# EAGLE design esp32_10 (EAGLE 7.3.0)
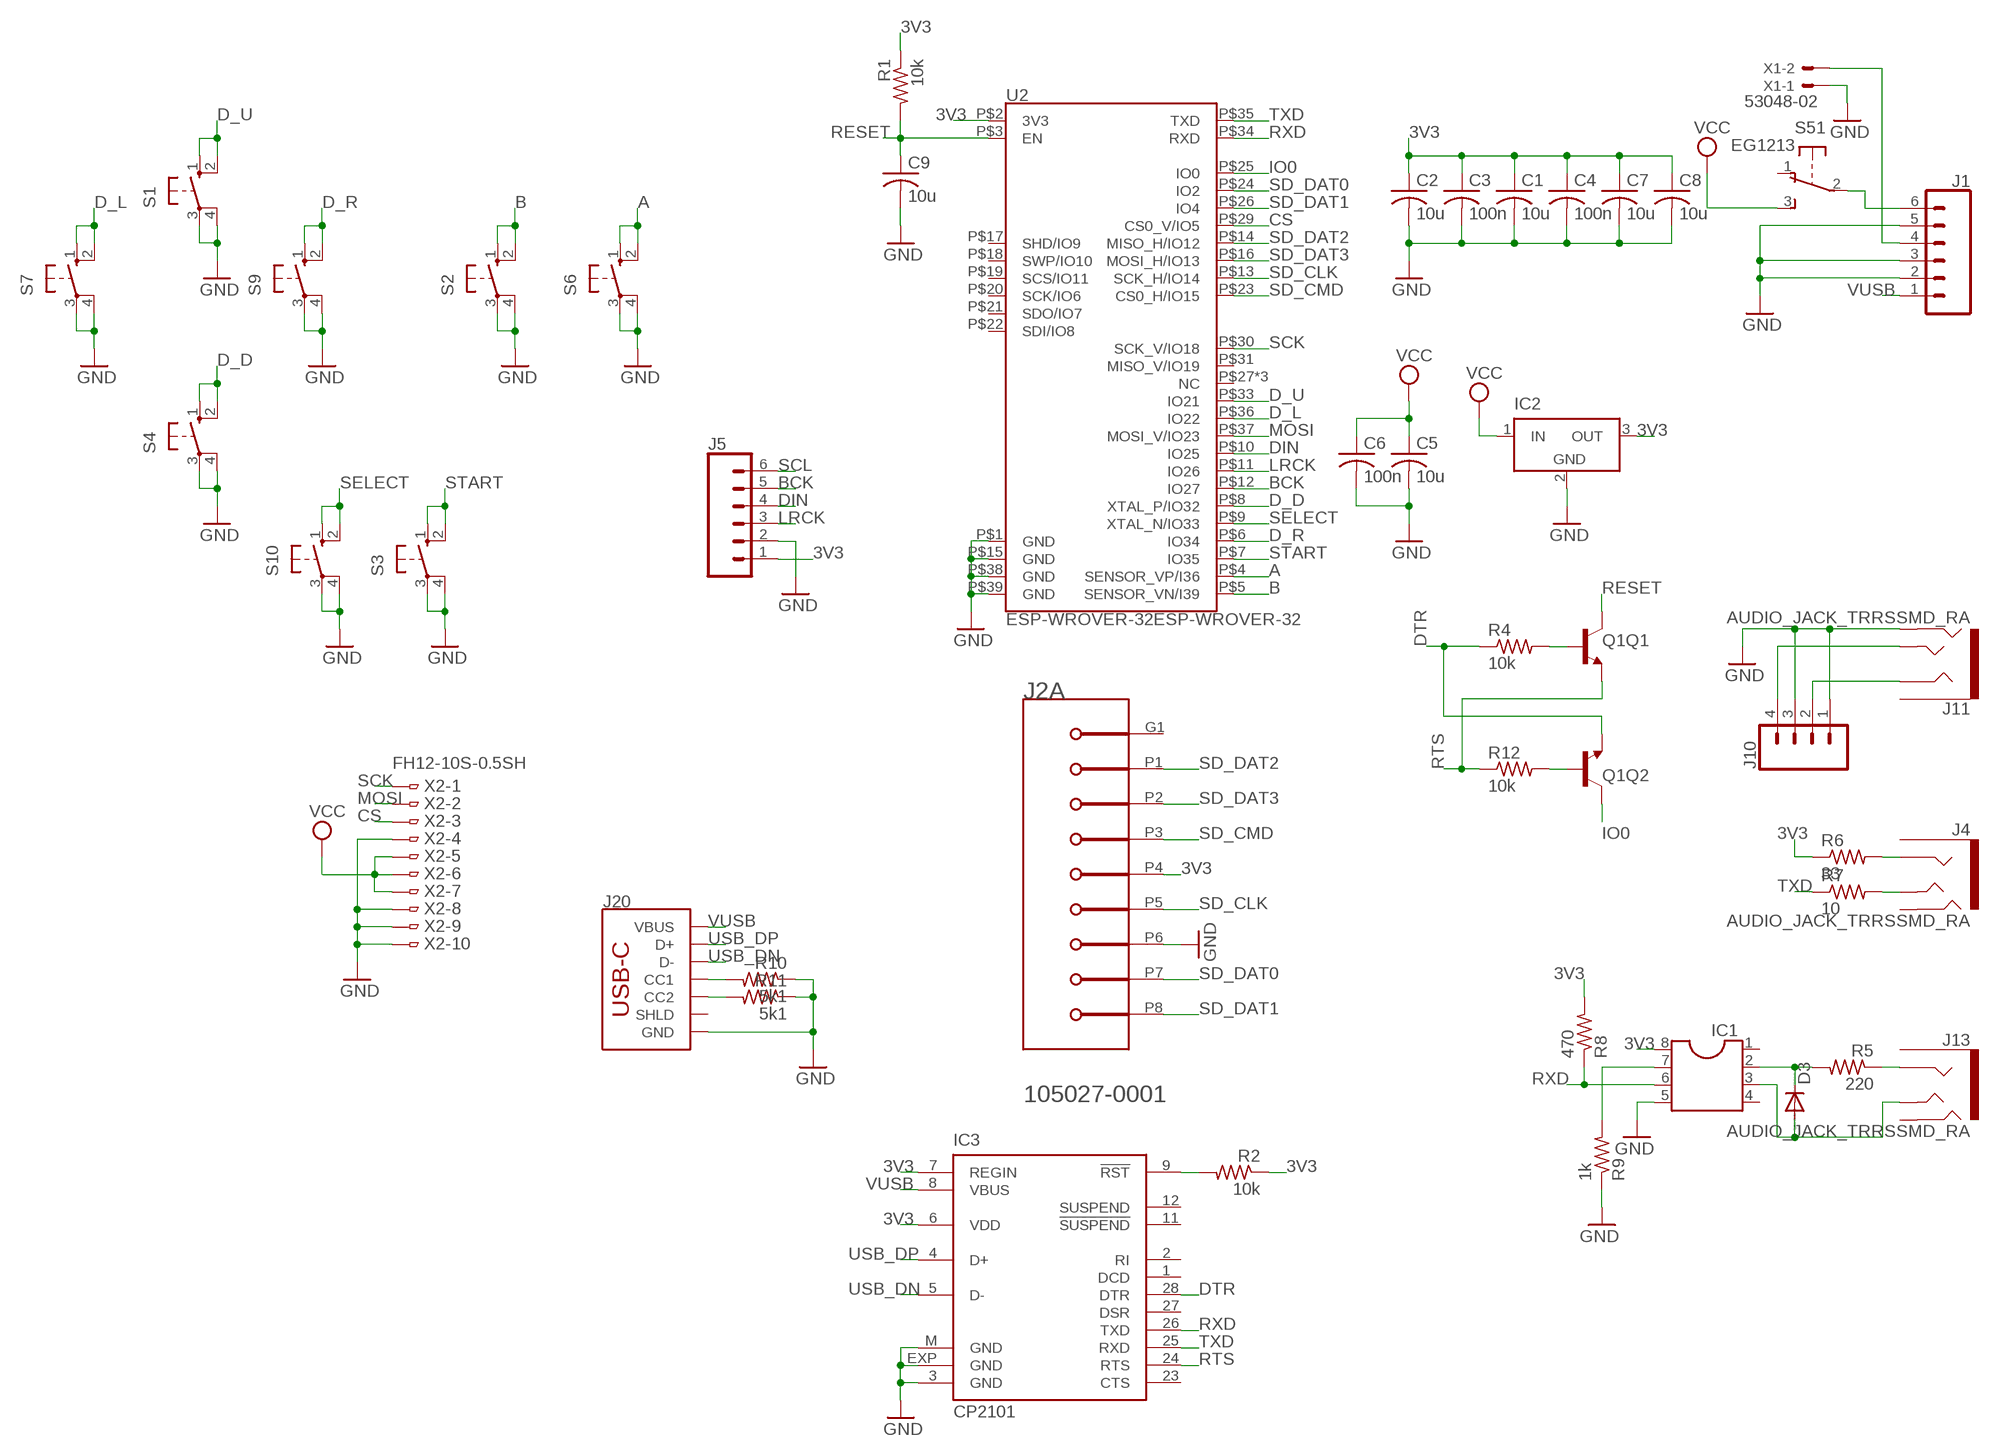
[diagram p0: schematic, sheet 1]

## Parts
C1  10u  C-USC0805  [C0805]
C2  10u  C-USC0805  [C0805]
C3  100n  C-USC0805  [C0805]
C4  100n  C-USC0805  [C0805]
C5  10u  C-USC0805  [C0805]
C6  100n  C-USC0805  [C0805]
C7  10u  C-USC0805  [C0805]
C8  10u  C-USC0805  [C0805]
C9  10u  C-USC0805  [C0805]
D3  DIODE-MINIMELF  [MINIMELF]
IC1  DIL8  [DIL08]
IC2  LT1129CST5  [SOT223]
IC3  CP2101  CP210X_USB_UART  [MLP28]
J1  CONN_06SILK_FEMALE_PTH  [1X06]
J2  MOLEX_INC_105027-0001MOLEX_INC_105027-0001_0_0  [MOLEX_INC_105027-0001_0]
J4  AUDIO_JACK_TRRSSMD_RA  [AUDIO_JACK_3.5MM_TRRS_SMD_RA]
J5  CONN_06SILK_FEMALE_PTH  [1X06]
J10  CONN_04  [1X04]
J11  AUDIO_JACK_TRRSSMD_RA  [AUDIO_JACK_3.5MM_TRRS_SMD_RA]
J13  AUDIO_JACK_TRRSSMD_RA  [AUDIO_JACK_3.5MM_TRRS_SMD_RA]
J20  USB_C_2-LAYER_PADS  [USB-C-16P-2LAYER-PADS]
Q1  TRANS_NPN_DUAL-MBT3904DW1T1  [SC70-6]
R1  10k  R-US_R0805  [R0805]
R2  10k  R-US_R0805  [R0805]
R4  10k  R-US_R0805  [R0805]
R5  220  R-US_R0805  [R0805]
R6  33  R-US_R0805  [R0805]
R7  10  R-US_R0805  [R0805]
R8  470  R-US_R0805  [R0805]
R9  1k  R-US_R0805  [R0805]
R10  5k1  R-US_R0805  [R0805]
R11  5k1  R-US_R0805  [R0805]
R12  10k  R-US_R0805  [R0805]
S1  10-XX  [B3F-10XX]
S2  10-XX  [B3F-10XX]
S3  10-XX  [B3F-10XX]
S4  10-XX  [B3F-10XX]
S5  EG1213  [EG1213]
S6  10-XX  [B3F-10XX]
S7  10-XX  [B3F-10XX]
S9  10-XX  [B3F-10XX]
S10  10-XX  [B3F-10XX]
U2  ESP-WROVER-32ESP-WROVER-32  [ESP-WROVER-32]
X1  53048-02  [53048-02]
X2  FH12-10S-0.5SH  [FH12-10S-0.5SH]

## Nets
3V3: C1.1 C2.1 C3.1 C4.1 C7.1 C8.1 IC1.8 IC2.3(OUT) IC3.6(VDD) IC3.7(REGIN) J2.P4(A:VDD) J5.1 R1.1 R2.1 R6.1 R8.2 U2.P$2(3V3)
A: S6.1(S) S6.2(S1) U2.P$4(SENSOR_VP/I36)
B: S2.1(S) S2.2(S1) U2.P$5(SENSOR_VN/I39)
BCK: J5.5 U2.P$12(IO27)
CS: U2.P$29(CS0_V/IO5) X2.3
D_D: S4.1(S) S4.2(S1) U2.P$8(XTAL_P/IO32)
D_L: S7.1(S) S7.2(S1) U2.P$36(IO22)
D_R: S9.1(S) S9.2(S1) U2.P$6(IO34)
D_U: S1.1(S) S1.2(S1) U2.P$33(IO21)
DIN: J5.4 U2.P$10(IO25)
DTR: IC3.28(DTR) Q1.1(Q2:E) R4.1
GND: C1.2 C2.2 C3.2 C4.2 C5.2 C6.2 C7.2 C8.2 C9.2 IC1.5 IC2.2(GND) IC3.3(GND) IC3.EXP(GND) IC3.M(GND) J1.2 J1.3 J1.5 J2.P6(A:VSS) J5.2 J10.1 J10.3 J11.RING2 J20.GND J20.GND2(GND) R9.1 R10.1 R11.1 S1.3(P) S1.4(P1) S2.3(P) S2.4(P1) S3.3(P) S3.4(P1) S4.3(P) S4.4(P1) S6.3(P) S6.4(P1) S7.3(P) S7.4(P1) S9.3(P) S9.4(P1) S10.3(P) S10.4(P1) U2.P$1(GND) U2.P$15(GND) U2.P$38(GND) U2.P$39(GND) X1.1 X2.4 X2.8 X2.9 X2.10
IO0: Q1.6(Q2:C) U2.P$25(IO0)
LRCK: J5.3 U2.P$11(IO26)
MOSI: U2.P$37(MOSI_V/IO23) X2.2
N$4: J10.4 J11.TIP
N$5: J10.2 J11.RING1
N$6: J1.4 X1.2
N$7: Q1.2(Q2:B) R12.2
N$8: J20.A5(CC1) R10.2
N$9: J20.B5(CC2) R11.2
N$10: Q1.5(Q1:B) R4.2
N$14: J4.RING1 R6.2
N$16: J4.TIP R7.2
N$17: J13.RING1 R5.1
N$18: D3.C IC1.2 R5.2
N$19: D3.A IC1.3 J13.TIP
N$22: IC1.7 R9.2
N$24: J1.6 S5.2(1:P)
N$26: IC3.9(!RST) R2.2
RESET: C9.1 Q1.3(Q1:C) R1.2 U2.P$3(EN)
RTS: IC3.24(RTS) Q1.4(Q1:E) R12.1
RXD: IC1.6 IC3.26(TXD) R8.1 U2.P$34(RXD)
SCK: U2.P$30(SCK_V/IO18) X2.1
SCL: J5.6
SD_CLK: J2.P5(A:CLK) U2.P$13(SCK_H/IO14)
SD_CMD: J2.P3(A:CMD) U2.P$23(CS0_H/IO15)
SD_DAT0: J2.P7(A:DAT0) U2.P$24(IO2)
SD_DAT1: J2.P8(A:DAT1) U2.P$26(IO4)
SD_DAT2: J2.P1(A:DAT2) U2.P$14(MISO_H/IO12)
SD_DAT3: J2.P2(A:CD/DAT3) U2.P$16(MOSI_H/IO13)
SELECT: S10.1(S) S10.2(S1) U2.P$9(XTAL_N/IO33)
START: S3.1(S) S3.2(S1) U2.P$7(IO35)
TXD: IC3.25(RXD) R7.1 U2.P$35(TXD)
USB_DN: IC3.5(D-) J20.A7(D-) J20.B7(D-)
USB_DP: IC3.4(D+) J20.A6(D+) J20.B6(D+)
VCC: C5.1 C6.1 IC2.1(IN) S5.3(1:S) X2.5 X2.6 X2.7
VUSB: IC3.8(VBUS) J1.1 J20.VBUS1(VBUS) J20.VBUS2(VBUS)
Unconnected: IC1.1 IC1.4 IC3.1(DCD) IC3.2(RI) IC3.11(!SUSPEND) IC3.12(SUSPEND) IC3.23(CTS) IC3.27(DSR) J2.1(B:MNT_1) J2.2(B:MNT_2) J2.3(B:MNT_3) J2.4(B:MNT_4) J2.G1(A:SWITCH) J4.EARTH J4.RING2 J11.EARTH J13.EARTH J13.RING2 J20.SHLD1(SHLD) J20.SHLD2(SHLD) J20.SHLD3(SHLD) J20.SHLD4(SHLD) S5.1(1:O) S5.MT1(MT) S5.MT2(MT) U2.P$17(SHD/IO9) U2.P$18(SWP/IO10) U2.P$19(SCS/IO11) U2.P$20(SCK/IO6) U2.P$21(SDO/IO7) U2.P$22(SDI/IO8) U2.P$27(NC) U2.P$28(NC) U2.P$31(MISO_V/IO19) U2.P$32(NC)

## Power pins joined to a net without a drawn wire
GND: IC2.4(GND)

## Library data of the parts
C1-C9 = rcl:C-US: CAPACITOR, American symbol
D3 = diode:DIODE-: DIODE
IC1 = ic-package:DIL8: Dual In Line / Socket
IC2 = linear-technology:LT1129CST5: VOLTAGE REGULATOR with shutdown; MPN: LT1129CST-5#PBF; OC_FARNELL: 1663375; OC_NEWARK: 57M2069
IC3 = SparkFun-Retired:CP210X_USB_UART: Single-Chip USB to UART Bridge Source: www.silabs.com .. CP2101.pdf / cp2102.pdf. Spark Fun Electronics SKU : COM-00310 RETIRED: IC-00865; PROD_ID: COM-00310
J1 J5 = lbr_SparkFun-Eagle-Libraries_SparkFun-Connectors:CONN_06: Multi connection point. Often used as Generic Header-pin footprint for 0.1 inch spaced/style header connections On any of the 0.1 inch spaced packages, you can populate with these: Break Away Headers - Straight <https://www.sparkfun.com/products/116> (PRT-00116) Break Away Male Headers - Right Angle <https://www.sparkfun.com/products/553> (PRT-00553) Female Headers <https://www.sparkfun.com/products/115> (PRT-00115) Break Away Headers - Machine Pin <https://www.sparkfun.com/products/117> (PRT-00117) Break Away Female Headers - Swiss Machine Pin <https://www.sparkfun.com/products/743> (PRT-00743) Arduino Stackable Header - 6 Pin <https://www.sparkfun.com/products/9280> (PRT-09280) For SCREWTERMINALS and SPRING TERMINALS visit here: Screw Terimnals on SparkFun.com <https://www.sparkfun.com/search/results?term=Screw+Terminals> (5mm/3.5mm/2.54mm spacing) This device is also useful as a general connection point to wire up your design to another part of your project. Our various solder wires solder well into these plated through hole pads. Hook-Up Wire - Assortment (Stranded, 22 AWG) <https://www.sparkfun.com/products/11375> (PRT-11375) Hook-Up Wire - Assortment (Solid Core, 22 AWG) <https://www.sparkfun.com/products/11367> (PRT-11367) View the entire wire category on our website here <https://www.sparkfun.com/categories/141>; PROD_ID: CONN-08437
J2 = Molex Inc - 105027-0001:MOLEX_INC_105027-0001: CONN MICRO SD CARD PUSH-PULL R/A; AUTOMOTIVE: No; CENTROID_NOT_SPECIFIED: No; CONN_ORIENTATION: Horizontal; CONTACT_MATERIAL: Gold,Nickel; CURRENT_RATING: 0.5A; DATASHEET: http://www.molex.com/webdocs/datasheets/pdf/en-us/1050270001_MEMORY_CARD_SOCKET.pdf; DEVICE_CLASS_L1: Connectors; DEVICE_CLASS_L2: Memory Connectors; DEVICE_CLASS_L3: unset; DIGIKEY_DESCRIPTION: CONN MICRO SD CARD PUSH-PULL R/A; DIGIKEY_PART_NUMBER: WM6825CT-ND; FOOTPRINT_URL: https://www.molex.com/pdm_docs/sd/1050270001_sd.pdf; FOOTPRINT_VARIANT_NAME_0: Recommended_Land_Pattern; HEIGHT: 1.85mm; IS_FEMALE: yes; LEAD_FREE: Yes; MEMORY_TYPE: FLASH; MF: Molex Inc; MFG_PACKAGE_IDENT: 105027-0001; MFG_PACKAGE_IDENT_DATE: 0; MFG_PACKAGE_IDENT_REV: 0; MOUSER_DESCRIPTION: Conn Micro SD Card HDR 8 POS 1.1mm Solder RA SMD Embossed T/R 0.5A/Contact; MOUSER_PART_NUMBER: 538-105027-0001; MPN: 105027-0001; NUMBER_OF_CONTACTS: 9; PACKAGE: CONN_SMT_SD; PREFIX: J; ROHS: Yes; SHIELDING: true; TEMPERATURE_RANGE_HIGH: +85°C; TEMPERATURE_RANGE_LOW: -40°C; VERIFICATION_VERSION: 0.0.0.1; VOLTAGE_RATING: 5V
J4 J11 J13 = lbr_SparkFun-Eagle-Libraries_SparkFun-Connectors:AUDIO_JACK_TRRS: Audio Jack - 3.5mm TRRS (SMD) This is a 3.5mm TRRS SMD audio jack. TRRS connectors are the audio-style connectors that you see on some phones, MP3 players and development boards. TRRS stands for “tip, ring, ring, sleeve,” which reflects that this has three conductors and a ground. SparkFun Products: Audio Jack <https://www.sparkfun.com/products/12639> mbed Starter Kit <https://www.sparkfun.com/products/12968> SparkFun TRRS 3.5mm Jack Breakout <https://www.sparkfun.com/products/11570>; PROD_ID: CONN-10676; SF_ID: PRT-12639
J10 = lbr_SparkFun-Eagle-Libraries_SparkFun-Connectors:CONN_04: Multi connection point. Often used as Generic Header-pin footprint for 0.1 inch spaced/style header connections On any of the 0.1 inch spaced packages, you can populate with these: Break Away Headers - Straight <https://www.sparkfun.com/products/116> (PRT-00116) Break Away Male Headers - Right Angle <https://www.sparkfun.com/products/553> (PRT-00553) Female Headers <https://www.sparkfun.com/products/115> (PRT-00115) Break Away Headers - Machine Pin <https://www.sparkfun.com/products/117> (PRT-00117) Break Away Female Headers - Swiss Machine Pin <https://www.sparkfun.com/products/743> (PRT-00743) For SCREWTERMINALS and SPRING TERMINALS visit here: Screw Terimnals on SparkFun.com <https://www.sparkfun.com/search/results?term=Screw+Terminals> (5mm/3.5mm/2.54mm spacing) This device is also useful as a general connection point to wire up your design to another part of your project. Our various solder wires solder well into these plated through hole pads. Hook-Up Wire - Assortment (Stranded, 22 AWG) <https://www.sparkfun.com/products/11375> (PRT-11375) Hook-Up Wire - Assortment (Solid Core, 22 AWG) <https://www.sparkfun.com/products/11367> (PRT-11367) View the entire wire category on our website here <https://www.sparkfun.com/categories/141> Special notes: Molex polarized connector foot print use with SKU : PRT-08231 with associated crimp pins and housings. 1MM SMD Version SKU: PRT-10208; PROD_ID: CONN-09696
J20 = SparkFun-Connectors:USB_C: USB Type C 16Pin Connector Super Speed pins not available on the 16-pin purely SMD connector so this part is best for USB 2.0 implementations. D1 and D2 are tied together enabling D+/- no matter which way the cable is plugged into the connector. The two channel configuration pins (CC1/2) are exposed. These are normally connected to ground via 5.1k resistors but can be reconfigured for high current/high power applications. **4-LAYER BOARD WARNING!!** If designing 4-layer board, make sure to select the variant _4-LAYER-ISOLATED. The linked footprint (USB-C-16-4LAYER-ISOLATED) includes some very necessary cutout polygons in the inner layers (2 and 15). This prevents the PTH mounting shield legs on the USB connector from electrically connecting any other polygons on the inner layers (usually VCC and GND).; PROD_ID: CONN-14122
Q1 = SparkFun-DiscreteSemi:TRANS_NPN_DUAL: Dual NPN Transistors in Single Package The MBT3904W1 puts two general purpose 3904 NPN transistors in a single package. Datasheet <http://www.onsemi.com/pub_link/Collateral/MBT3904DW1T1-D.PDF> SparkFun Products: SparkFun ESP32 Thing <https://www.sparkfun.com/products/13907>; PROD_ID: TRANS-13337
R1 R2 R4-R12 = rcl:R-US_: RESISTOR, American symbol
S1-S4 S6 S7 S9 S10 = switch-omron:10-XX: OMRON SWITCH; MPN: B3F-1000; OC_FARNELL: 176432; OC_NEWARK: 36M3542
S5 = adafruit:EG1213: E-Switch right-angle slide SPDT Part #EG1213 http://www.ladyada.net/library/eagle
U2 = SparkFun-RF:ESP-WROVER-32
X1 = con-molex:53?-02: CONNECTOR wire to board 1.25 mm (.049 inch) pitch header; MF: MOLEX; MPN: 53048-0210; OC_FARNELL: 1012259; OC_NEWARK: 57H4718
X2 = con-hirose:FH12-10S-0.5S: 0.5mm Pitch Connectors For FPC/FFC Source: Data sheet <http://www.hirose.co.jp/cataloge_hp/e58605370.pdf>; MPN: FH12-10S-0.5SH(55); OC_FARNELL: 1324540; OC_NEWARK: 34M6152

## Board
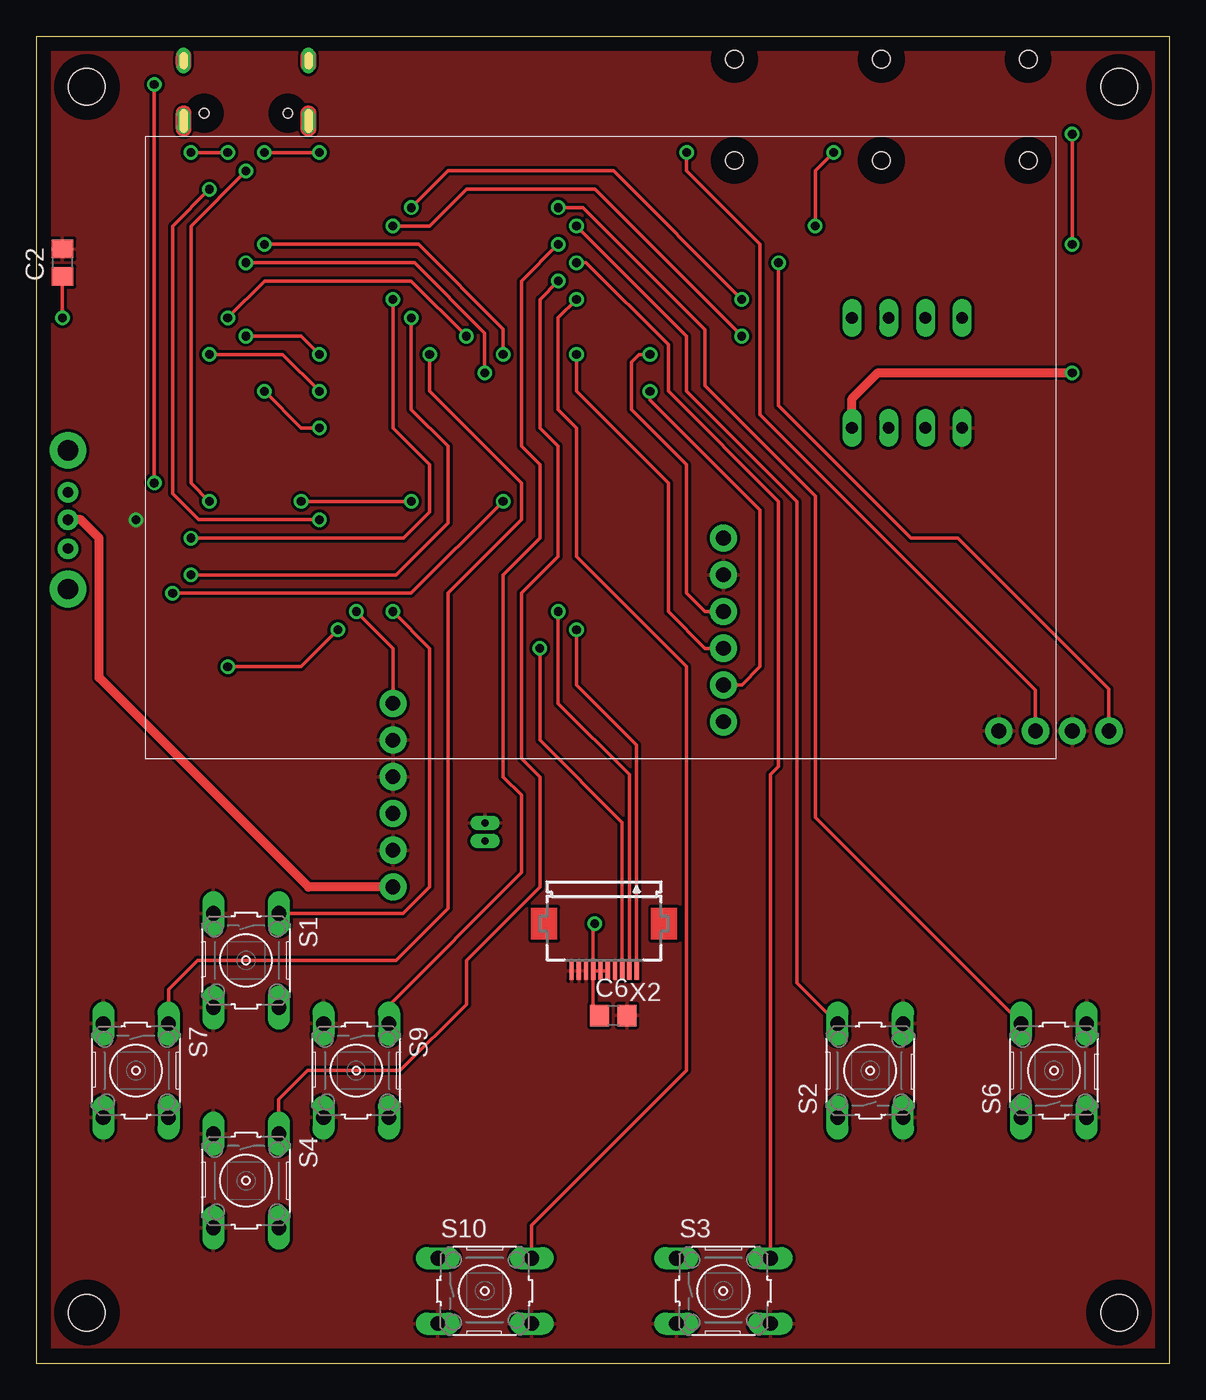
[diagram p1: board, top side]
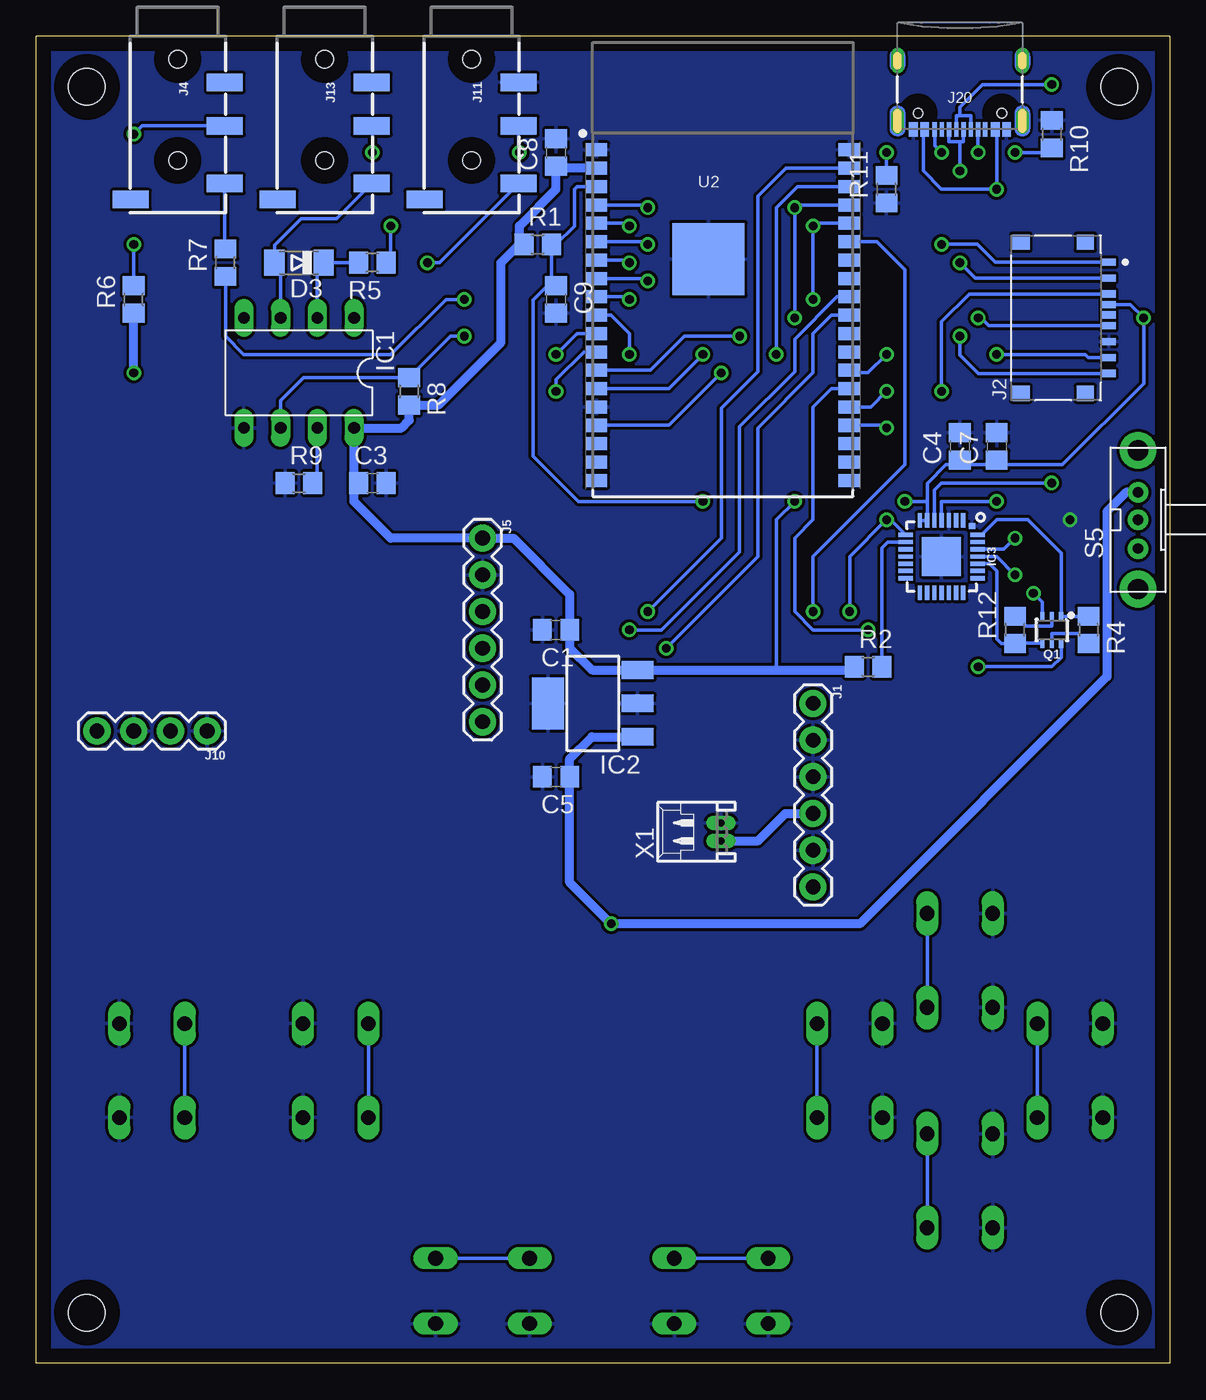
[diagram p2: board, bottom side, seen from below]

Size 78.42 x 91.8 mm. Coordinates in mm from the lower left corner, seen from the top.
Outline: 0,91.8 0,0 78.42,0 78.42,91.8 0,91.8
Copper layers (1*16): Top 0.035mm / dielectric 1.5mm / Bottom 0.035mm
Design rules "default *": minimum track width 8mil, minimum drill 24mil, track to track 8mil, track to pad 8mil, pad to pad 8mil, via to via 8mil, smd to smd 8mil, copper to edge 40mil, drill to drill 8mil, minimum pad ring 10mil, minimum via ring 8mil, stop-mask expansion 4mil, vias tented up to drill 0mil, thermal gap 8mil
Holes 2.5 mm at 3.5,88.3 74.92,88.3 3.5,3.5 74.92,3.5

### Footprints (pad centres in the part's own frame; a part is rotated, then mirrored left to right if it is on the bottom)
C0805 = smd 1.3 x 1.5: 1 -0.95,0; 2 0.95,0
MINIMELF = smd 1.4 x 1.8: A 1.7,0; C -1.7,0
DIL08 = drill 0.813 long: 1 -3.81,-3.81; 2 -1.27,-3.81; 3 1.27,-3.81; 4 3.81,-3.81; 5 3.81,3.81; 6 1.27,3.81; 7 -1.27,3.81; 8 -3.81,3.81
SOT223 = smd 1.219 x 2.235: 1 -2.311,-3.099; 2 0,-3.099; 3 2.311,-3.099 | smd 3.6 x 2.2: 4 0,3.099
MLP28 = smd 1 x 0.3: 1 -2.5,1.5; 2 -2.5,1; 3 -2.5,0.5; 4 -2.5,0; 5 -2.5,-0.5; 6 -2.5,-1; 7 -2.5,-1.5; 15 2.5,-1.5; 16 2.5,-1; 17 2.5,-0.5; 18 2.5,0; 19 2.5,0.5; 20 2.5,1; 21 2.5,1.5 | smd 0.3 x 1: 8 -1.5,-2.5; 9 -1,-2.5; 10 -0.5,-2.5; 11 0,-2.5; 12 0.5,-2.5; 13 1,-2.5; 14 1.5,-2.5; 22 1.5,2.5; 23 1,2.5; 24 0.5,2.5; 25 0,2.5; 26 -0.5,2.5; 27 -1,2.5; 28 -1.5,2.5 | smd 2.7 x 2.7: EXP 0,0 | smd 0.435 x 0.435: M -2.103,2.103
1X06 = drill 1.016 pad 1.88: 1 0,0; 2 2.54,0; 3 5.08,0; 4 7.62,0; 5 10.16,0; 6 12.7,0
MOLEX_INC_105027-0001_0 = smd 1.05 x 1.2: 1 -5.225,2.13; 2 5.225,2.13; 3 -5.225,-2.32; 4 5.225,-2.32 | smd 0.5 x 1: G1 0.2,-3.93; P1 3.85,-3.93; P2 2.75,-3.93; P3 1.65,-3.93; P4 0.9,-3.93; P5 -0.55,-3.93; P6 -1.65,-3.93; P7 -2.75,-3.93; P8 -3.85,-3.93
AUDIO_JACK_3.5MM_TRRS_SMD_RA = smd 1.2 x 2.5: EARTH 11.3,-3.25; RING1 6.2,3.25; RING2 3.2,3.25; TIP 10.2,3.25 | hole 1.2: 1.6,0; 8.6,0
1X04 = drill 1.016 pad 1.88: 1 0,0; 2 2.54,0; 3 5.08,0; 4 7.62,0
USB-C-16P-2LAYER-PADS = smd 0.3 x 1: A5 -1.25,-0.34; A6 -0.25,-0.34; A7 0.25,-0.34; A8 1.25,-0.34; B5 1.75,-0.34; B6 0.75,-0.34; B7 -0.75,-0.34; B8 -1.75,-0.34 | smd 0.6 x 1: GND -3.225,-0.34; GND2 3.225,-0.34; VBUS1 -2.45,-0.34; VBUS2 2.45,-0.34 | drill 0.4 pad 0.6 long: SHLD1 -4.318,-0.915; SHLD2 4.318,-0.915; SHLD3 -4.318,-5.095; SHLD4 4.318,-5.095 | hole 0.65: -2.89,-1.445; 2.89,-1.445
SC70-6 = smd 0.3 x 0.66: 1 -0.65,-0.92; 2 0,-0.92; 3 0.65,-0.92; 4 0.65,0.92; 5 0,0.92; 6 -0.65,0.92
R0805 = smd 1.3 x 1.5: 1 -0.95,0; 2 0.95,0
B3F-10XX = drill 1.016 long: 1 -3.251,2.261; 2 3.251,2.261; 3 -3.251,-2.261; 4 3.251,-2.261
EG1213 = drill 0.7 pad 1.422: 1 -2,0; 2 0,0; 3 1.9,0 | drill 1.4 pad 2.54: MT1 -4.8,0; MT2 4.8,0
ESP-WROVER-32 = smd 1.5 x 0.9: P$1 0.25,-7.44; P$2 0.25,-8.71; P$3 0.25,-9.98; P$4 0.25,-11.25; P$5 0.25,-12.52; P$6 0.25,-13.79; P$7 0.25,-15.06; P$8 0.25,-16.33; P$9 0.25,-17.6; P$10 0.25,-18.87; P$11 0.25,-20.14; P$12 0.25,-21.41; P$13 0.25,-22.68; P$14 0.25,-23.95; P$15 0.25,-25.22; P$16 0.25,-26.49; P$17 0.25,-27.76; P$18 0.25,-29.03; P$19 0.25,-30.3; P$20 17.75,-30.3; P$21 17.75,-29.03; P$22 17.75,-27.76; P$23 17.75,-26.49; P$24 17.75,-25.22; P$25 17.75,-23.95; P$26 17.75,-22.68; P$27 17.75,-21.41; P$28 17.75,-20.14; P$29 17.75,-18.87; P$30 17.75,-17.6; P$31 17.75,-16.33; P$32 17.75,-15.06; P$33 17.75,-13.79; P$34 17.75,-12.52; P$35 17.75,-11.25; P$36 17.75,-9.98; P$37 17.75,-8.71; P$38 17.75,-7.44 | smd 5 x 5: P$39 8,-15
53048-02 = drill 0.5 pad 0.698 long: 1 0.625,-1.25; 2 -0.625,-1.25
FH12-10S-0.5SH = smd 0.3 x 1.3: 1 -2.25,3.25; 2 -1.75,3.25; 3 -1.25,3.25; 4 -0.75,3.25; 5 -0.25,3.25; 6 0.25,3.25; 7 0.75,3.25; 8 1.25,3.25; 9 1.75,3.25; 10 2.25,3.25

### Placement (x,y rotation side)
C1  42.46,50.73 180 bottom
C2  1.82,76.13 90 top
C3  55.16,60.89 0 bottom
C4  14.52,63.43 90 bottom
C5  42.46,40.57 180 bottom
C6  39.92,24.06 0 top
C7  11.98,63.43 90 bottom
C8  42.46,83.75 90 bottom
C9  42.46,73.59 270 bottom
D3  60.24,76.13 180 bottom
IC1  60.24,68.51 180 bottom
IC2  39.92,45.65 90 bottom
IC3  15.79,55.81 270 bottom
J1  24.68,45.65 270 bottom
J2  8.17,72.32 90 bottom
J4  68.62,91.8 270 bottom
J5  47.54,57.08 270 bottom
J10  66.59,43.74 180 bottom
J11  48.3,91.8 270 bottom
J13  58.46,91.8 270 bottom
J20  14.52,85.02 180 bottom
Q1  8.17,50.73 180 bottom
R1  43.73,77.4 0 bottom
R2  20.87,48.19 0 bottom
R4  5.63,50.73 270 bottom
R5  55.16,76.13 180 bottom
R6  71.67,73.59 90 bottom
R7  65.32,76.13 90 bottom
R8  52.62,67.24 270 bottom
R9  60.24,60.89 0 bottom
R10  8.17,85.02 270 bottom
R11  19.6,81.21 90 bottom
R12  10.71,50.73 90 bottom
S1  14.52,27.87 270 top
S2  57.7,20.25 90 top
S3  47.54,5.01 0 top
S4  14.52,12.63 270 top
S5  2.2,58.35 90 bottom
S6  70.4,20.25 90 top
S7  6.9,20.25 270 top
S9  22.14,20.25 270 top
S10  31.03,5.01 0 top
U2  39.92,91.37 0 bottom
X1  32.3,36.76 90 bottom
X2  39.29,30.41 180 top

### Tracks (layer width: path | path; a pad name or v marks a point on that pad's centre or on a via)
3V3  (via drill 0.6)
  Top 0.254: v25.95,59.62 v18.33,59.62 | C2.1 v1.82,72.32
  Top 0.61: IC1.8 56.43,66.71 58.23,68.51 v71.67,68.51
  Bottom 0.254: J2.P4 2.72,73.22 v1.82,72.32 1.82,67.77 7.43,62.16 11.98,62.16 | 16.79,59.62 16.79,60.86 15.49,62.16 14.52,62.16 | 16.79,59.62 IC3.6 IC3.7 | v18.33,59.62 16.79,59.62 | 11.98,62.16 14.52,62.16 | 14.52,62.16 C4.1 | C7.1 11.98,62.16 | v25.95,59.62 27.22,58.35 27.22,47.96
  Bottom 0.61: 56.43,60.89 IC1.8 53.15,64.7 52.62,65.23 R8.2 50.59,66.29 46.27,70.61 46.27,76.13 45,77.4 | v71.67,68.51 R6.1 | 56.43,60.89 56.43,59.62 53.89,57.08 J5.1 45.41,57.08 41.51,53.18 C1.1 41.51,49.49 39.98,47.96 IC2.3 27.22,47.96 21.82,47.96 R2.1 | 56.43,60.89 C3.1 | U2.P$2 42.46,82.66 C8.1 42.46,81.21 45,78.67 45,77.4 | R1.1 45,77.4
A  (via drill 0.6)
  Top 0.254: S6.2 53.89,37.75 53.89,60 46.27,67.62 46.27,71.49 37.82,79.94 v36.11,79.94
  Bottom 0.254: S6.2 S6.1 | U2.P$4 36.29,80.12 v36.11,79.94
B  (via drill 0.6)
  Top 0.254: S2.2 52.62,26.32 52.62,59.62 45,67.24 45,71.05 v37.38,78.67
  Bottom 0.254: S2.2 S2.1 | U2.P$5 37.56,78.85 v37.38,78.67
BCK  (via drill 0.6)
  Top 0.254: J5.5 48.81,46.92 50.08,48.19 50.08,59 42.46,66.62 v42.46,67.24
  Bottom 0.254: U2.P$12 40.53,69.96 42.46,68.03 v42.46,67.24
CS  (via drill 0.6)
  Top 0.254: v34.84,49.46 34.84,43.11 40.54,37.41 X2.3
  Bottom 0.254: U2.P$29 23.4,72.5 24.68,71.22 24.68,68.51 28.49,64.7 28.49,55.81 v34.84,49.46
D_D  (via drill 0.6)
  Top 0.254: v36.11,74.86 34.84,73.59 34.84,64.7 36.11,63.43 36.11,55.81 33.57,53.27 33.57,41.84 34.84,40.57 34.84,32.95 29.76,27.87 29.76,24.83 25.18,20.25 18.78,20.25 16.78,18.25 S4.1
  Bottom 0.254: S4.1 S4.2 | U2.P$8 36.29,75.04 v36.11,74.86
D_L  (via drill 0.6)
  Top 0.254: v27.22,69.78 27.22,67.24 33.57,60.89 33.57,58.35 28.49,53.27 28.49,31.46 24.9,27.87 11.16,27.87 9.16,25.87 S7.1
  Bottom 0.254: S7.1 S7.2 | U2.P$36 25.77,81.39 27.22,79.94 v27.22,69.78
D_R  (via drill 0.6)
  Top 0.254: v36.11,77.4 33.57,74.86 33.57,63.43 34.84,62.16 34.84,57.08 32.3,54.54 32.3,40.57 33.57,39.3 33.57,33.94 24.4,24.77 S9.1
  Bottom 0.254: S9.2 S9.1 | U2.P$6 36.29,77.58 v36.11,77.4
D_U  (via drill 0.6)
  Top 0.254: v24.68,52 27.22,49.46 27.22,32.95 25.39,31.12 S1.1
  Bottom 0.254: S1.1 S1.2 | U2.P$33 20.26,77.58 18.33,75.65 18.33,62.16 24.68,55.81 v24.68,52
DIN  (via drill 0.6)
  Top 0.254: v37.38,69.78 37.38,67.24 43.73,60.89 43.73,52 46.27,49.46 J5.4
  Bottom 0.254: U2.P$10 38.66,72.5 37.38,71.22 v37.38,69.78
DTR
  Bottom 0.254: R4.1 5.63,51.65 Q1.1 7.52,56.05 9.82,58.35 11.98,58.35 13.02,57.31 IC3.28
GND  (via drill 0.6)
  other vias: 6.9,58.35
  pour Bottom: -0.72,92.64 79.29,92.64 79.29,-1.34 -0.72,-1.34
  pour Top: 79.29,92.64 79.29,-1.34 -0.72,-1.34 -0.72,92.64
IO0  (via drill 0.6)
  Top 0.254: v13.25,48.19 18.33,48.19 v20.87,50.73
  Bottom 0.254: Q1.6 7.52,48.81 8.17,48.19 v13.25,48.19 | U2.P$25 23.4,67.42 24.68,66.14 24.68,58.35 25.95,57.08 25.95,52 24.68,50.73 v20.87,50.73
LRCK  (via drill 0.6)
  Top 0.254: v42.46,69.78 41.72,69.78 41.19,69.25 41.19,65.97 45,62.16 45,53.27 46.27,52 J5.3
  Bottom 0.254: U2.P$11 41.01,71.23 v42.46,69.78
MOSI  (via drill 0.6)
  Top 0.254: X2.2 41.04,40.73 36.11,45.65 v36.11,52
  Bottom 0.254: U2.P$37 26.56,82.66 28.49,80.73 28.49,68.6 31.03,66.06 31.03,57.08 v36.11,52
N$4  (via drill 0.6)
  Top 0.254: v51.35,76.13 51.35,66.24 60.51,57.08 63.77,57.08 74.21,46.64 J10.4
  Bottom 0.254: v51.35,76.13 50.52,76.13 J11.TIP
N$5  (via drill 0.6)
  Top 0.254: v45,83.75 45,82.48 50.08,77.4 50.08,65.61 69.13,46.56 J10.2
  Bottom 0.254: v45,83.75 45.05,83.75 J11.RING1
N$6
  Bottom 0.61: X1.2 28.49,36.13 26.59,38.03 J1.4
N$7
  Bottom 0.254: Q1.2 8.17,50.98 10.01,50.98 R12.2
N$8  (via drill 0.6)
  Top 0.254: v10.71,83.75 v13.25,83.75
  Bottom 0.254: v13.25,83.75 13.27,83.75 J20.A5 | v10.71,83.75 8.17,83.75 R10.2
N$9  (via drill 0.6)
  Top 0.254: v19.6,83.75 v15.79,83.75
  Bottom 0.254: R11.2 v19.6,83.75 | v15.79,83.75 16.27,84.23 J20.B5
N$10
  Bottom 0.254: R4.2 6.33,50.48 8.17,50.48 Q1.5
N$14  (via drill 0.6)
  Top 0.254: v71.67,77.4 v71.67,85.02
  Bottom 0.254: J4.RING1 71.09,85.6 v71.67,85.02 | R6.2 v71.67,77.4
N$16
  Bottom 0.254: R7.2 65.37,77.08 J4.TIP
N$17  (via drill 0.6)
  Top 0.254: v55.16,83.75 53.89,82.48 v53.89,78.67
  Bottom 0.254: R5.1 53.89,76.13 v53.89,78.67 | J13.RING1 55.16,85.6 v55.16,83.75
N$18
  Bottom 0.254: IC1.2 58.97,75.7 D3.C R5.2
N$19
  Bottom 0.254: IC1.3 61.51,75.7 D3.A 61.94,77.35 60.1,79.19 57.62,79.19 J13.TIP
N$22
  Bottom 0.254: R9.2 58.97,61.21 IC1.7
N$24
  Top 0.61: J1.6 18.84,32.95 4.36,47.43 4.36,57.08 3.09,58.35 S5.2
N$26
  Bottom 0.254: IC3.9 19.5,56.81 19.92,56.39 R2.2
RESET  (via drill 0.6)
  Top 0.254: v9.44,53.27 25.95,53.27 v32.3,59.62
  Bottom 0.254: U2.P$3 41.01,81.39 41.19,81.21 41.19,78.67 42.46,77.4 R1.2 42.78,74.54 | Q1.3 8.82,52.65 v9.44,53.27 | v32.3,59.62 40.92,59.62 44.05,62.75 44.05,73.54 43.05,74.54 42.78,74.54 | C9.1 42.78,74.54
RTS
  Bottom 0.254: Q1.4 10.71,49.81 R12.1 11.66,49.78 11.98,50.1 11.98,54.81 12.48,55.31 IC3.24
RXD  (via drill 0.6)
  Top 0.254: v24.68,78.67 27.22,78.67 29.76,81.21 38.65,81.21 v48.81,71.05 | v24.68,73.59 24.68,64.7 27.22,62.16 27.22,58.88 25.42,57.08 v10.71,57.08
  Bottom 0.254: IC1.6 61.51,66.6 59.92,68.19 R8.1 49.76,71.05 v48.81,71.05 | U2.P$34 24.5,78.85 v24.68,78.67 v24.68,73.59 | IC3.26 11.48,56.31 v10.71,57.08
SCK  (via drill 0.6)
  Top 0.254: v37.38,50.73 37.38,46.92 41.54,42.77 X2.1
  Bottom 0.254: U2.P$30 23.02,73.77 25.95,70.84 25.95,68.59 29.76,64.78 29.76,56.12 35.15,50.73 v37.38,50.73
SD_CLK  (via drill 0.6)
  Top 0.254: v29.76,71.05 25.95,74.86 15.79,74.86 v13.25,72.32
  Bottom 0.254: U2.P$13 35.93,68.69 33.57,71.05 v29.76,71.05 | J2.P5 12.53,71.77 13.08,72.32 v13.25,72.32
SD_CMD  (via drill 0.6)
  Top 0.254: v19.6,64.7 18.33,64.7 v15.79,67.24
  Bottom 0.254: J2.P3 13.88,73.97 15.79,72.06 v15.79,67.24 | U2.P$23 19.78,64.88 v19.6,64.7
SD_DAT0  (via drill 0.6)
  Top 0.254: v19.6,67.24 17.06,69.78 v11.98,69.78
  Bottom 0.254: J2.P7 5.63,69.57 5.84,69.78 v11.98,69.78 | U2.P$24 20.69,66.15 v19.6,67.24
SD_DAT1  (via drill 0.6)
  Top 0.254: v14.52,71.05 18.33,71.05 v19.6,69.78
  Bottom 0.254: J2.P8 13.25,68.47 14.52,69.74 v14.52,71.05 | U2.P$26 22.17,68.51 20.87,68.51 v19.6,69.78
SD_DAT2  (via drill 0.6)
  Top 0.254: v32.3,69.78 32.3,71.55 26.45,77.4 v15.79,77.4
  Bottom 0.254: J2.P1 12.08,76.17 13.31,77.4 v15.79,77.4 | U2.P$14 34.66,67.42 v32.3,69.78
SD_DAT3  (via drill 0.6)
  Top 0.254: v31.03,68.51 31.03,71.27 26.17,76.13 v14.52,76.13
  Bottom 0.254: J2.P2 13.46,75.07 v14.52,76.13 | U2.P$16 34.66,64.88 v31.03,68.51
SELECT  (via drill 0.6)
  Top 0.254: v37.38,73.59 36.11,72.32 36.11,65.97 37.38,64.7 37.38,55.81 45,48.19 45,20.25 34.28,9.53 S10.2
  Bottom 0.254: S10.2 S10.1 | U2.P$9 37.56,73.77 v37.38,73.59
START  (via drill 0.6)
  Top 0.254: v37.38,76.13 38.05,76.13 43.73,70.45 43.73,67.24 51.35,59.62 51.35,41.28 50.79,40.72 S3.2
  Bottom 0.254: S3.2 S3.1 | U2.P$7 37.56,76.31 v37.38,76.13
TXD  (via drill 0.6)
  Top 0.254: v48.81,73.59 39.92,82.48 28.49,82.48 v25.95,79.94 | v25.95,72.32 25.95,65.97 28.49,63.43 28.49,58.13 24.9,54.54 v10.71,54.54
  Bottom 0.254: R7.1 65.32,71.05 64.05,69.78 53.89,69.78 50.08,73.59 v48.81,73.59 | U2.P$35 25.77,80.12 v25.95,79.94 v25.95,72.32 | IC3.25 11.98,55.81 v10.71,54.54
USB_DN  (via drill 0.6)
  Top 0.254: v8.17,88.45 v8.17,60.89
  Bottom 0.254: 14.52,86.29 13.77,86.29 J20.B7 | 14.52,86.29 14.77,86.29 J20.A7 | v8.17,88.45 12.97,88.45 14.52,86.9 14.52,86.29 | v8.17,60.89 15.79,60.89 16.29,60.39 IC3.5
USB_DP  (via drill 0.6)
  Top 0.254: v14.52,82.48 10.71,78.67 10.71,60.89 v11.98,59.62
  Bottom 0.254: J20.A6 14.27,84.51 14.52,84.51 | J20.B6 15.27,84.51 14.52,84.51 | 14.52,84.51 v14.52,82.48 | v11.98,59.62 15.79,59.62 IC3.4
VCC  (via drill 0.6)
  Top 0.254: X2.5 X2.6 X2.7 | C6.1 38.54,24.06 X2.7 | v38.65,30.41 38.54,30.3 X2.7
  Bottom 0.254: C5.1 41.19,40.57
  Bottom 0.61: IC2.1 39.98,43.34 41.51,41.81 C5.1 41.51,33.27 v38.65,30.41 21.45,30.41 4.36,47.5 4.36,58.9 3.01,60.25 S5.3
VUSB  (via drill 0.6)
  Top 0.254: v19.6,58.35 11.24,58.35 9.44,60.15 9.44,78.67 v11.98,81.21 | J1.1 24.68,49.46 v22.14,52
  Bottom 0.254: J20.VBUS2 17.06,85.36 17.06,82.48 15.79,81.21 v11.98,81.21 11.98,85.36 J20.VBUS1 | 18.33,57.31 IC3.8 19.33,58.35 v19.6,58.35 22.14,55.81 v22.14,52